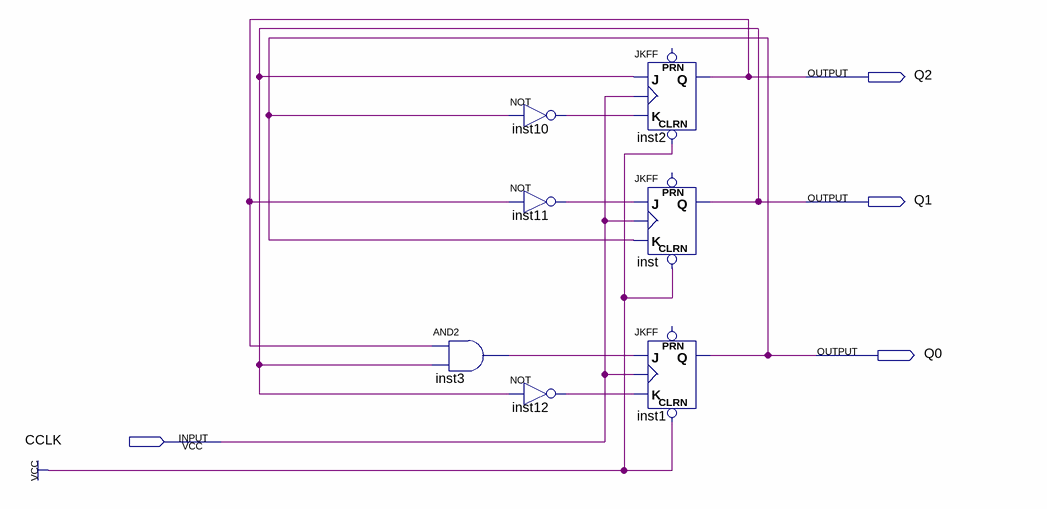
[diagram p0: schematic sheet]
// Quartus schematic counter1.bdf as structural Verilog: 7 symbols, 4 pins
module counter1 (
  input  CCLK,
  output Q2,
  output Q1,
  output Q0
);

  wire inst3_out, inst10_out, inst11_out, inst12_out;

  and inst3 (inst3_out, Q2, Q1);
  not inst10 (inst10_out, Q0);
  not inst11 (inst11_out, Q2);
  not inst12 (inst12_out, Q1);
  JKFF inst2 (.CLRN(1'b1), .K(inst10_out), .J(Q1), .CLK(CCLK), .Q(Q2));  // open: PRN
  JKFF inst (.CLRN(1'b1), .K(Q0), .J(inst11_out), .CLK(CCLK), .Q(Q1));  // open: PRN
  JKFF inst1 (.CLRN(1'b1), .K(inst12_out), .J(inst3_out), .CLK(CCLK), .Q(Q0));  // open: PRN
endmodule
